# EasyEDA Pro project esp32-toy-motor-controller.eprj

# Schematic ESP32 Toy Motor Controller
Board Name: ESP32ToyMotorBoard; Create Date: 2026-01-25; Page Name: P1; Project Name: esp32-toy-motor-controller; Schematic Name: ESP32 Toy Motor Controller; Update Date: 2026-02-21; Company: stig@sdm.nz; Page Size: A4; Version: V1.1
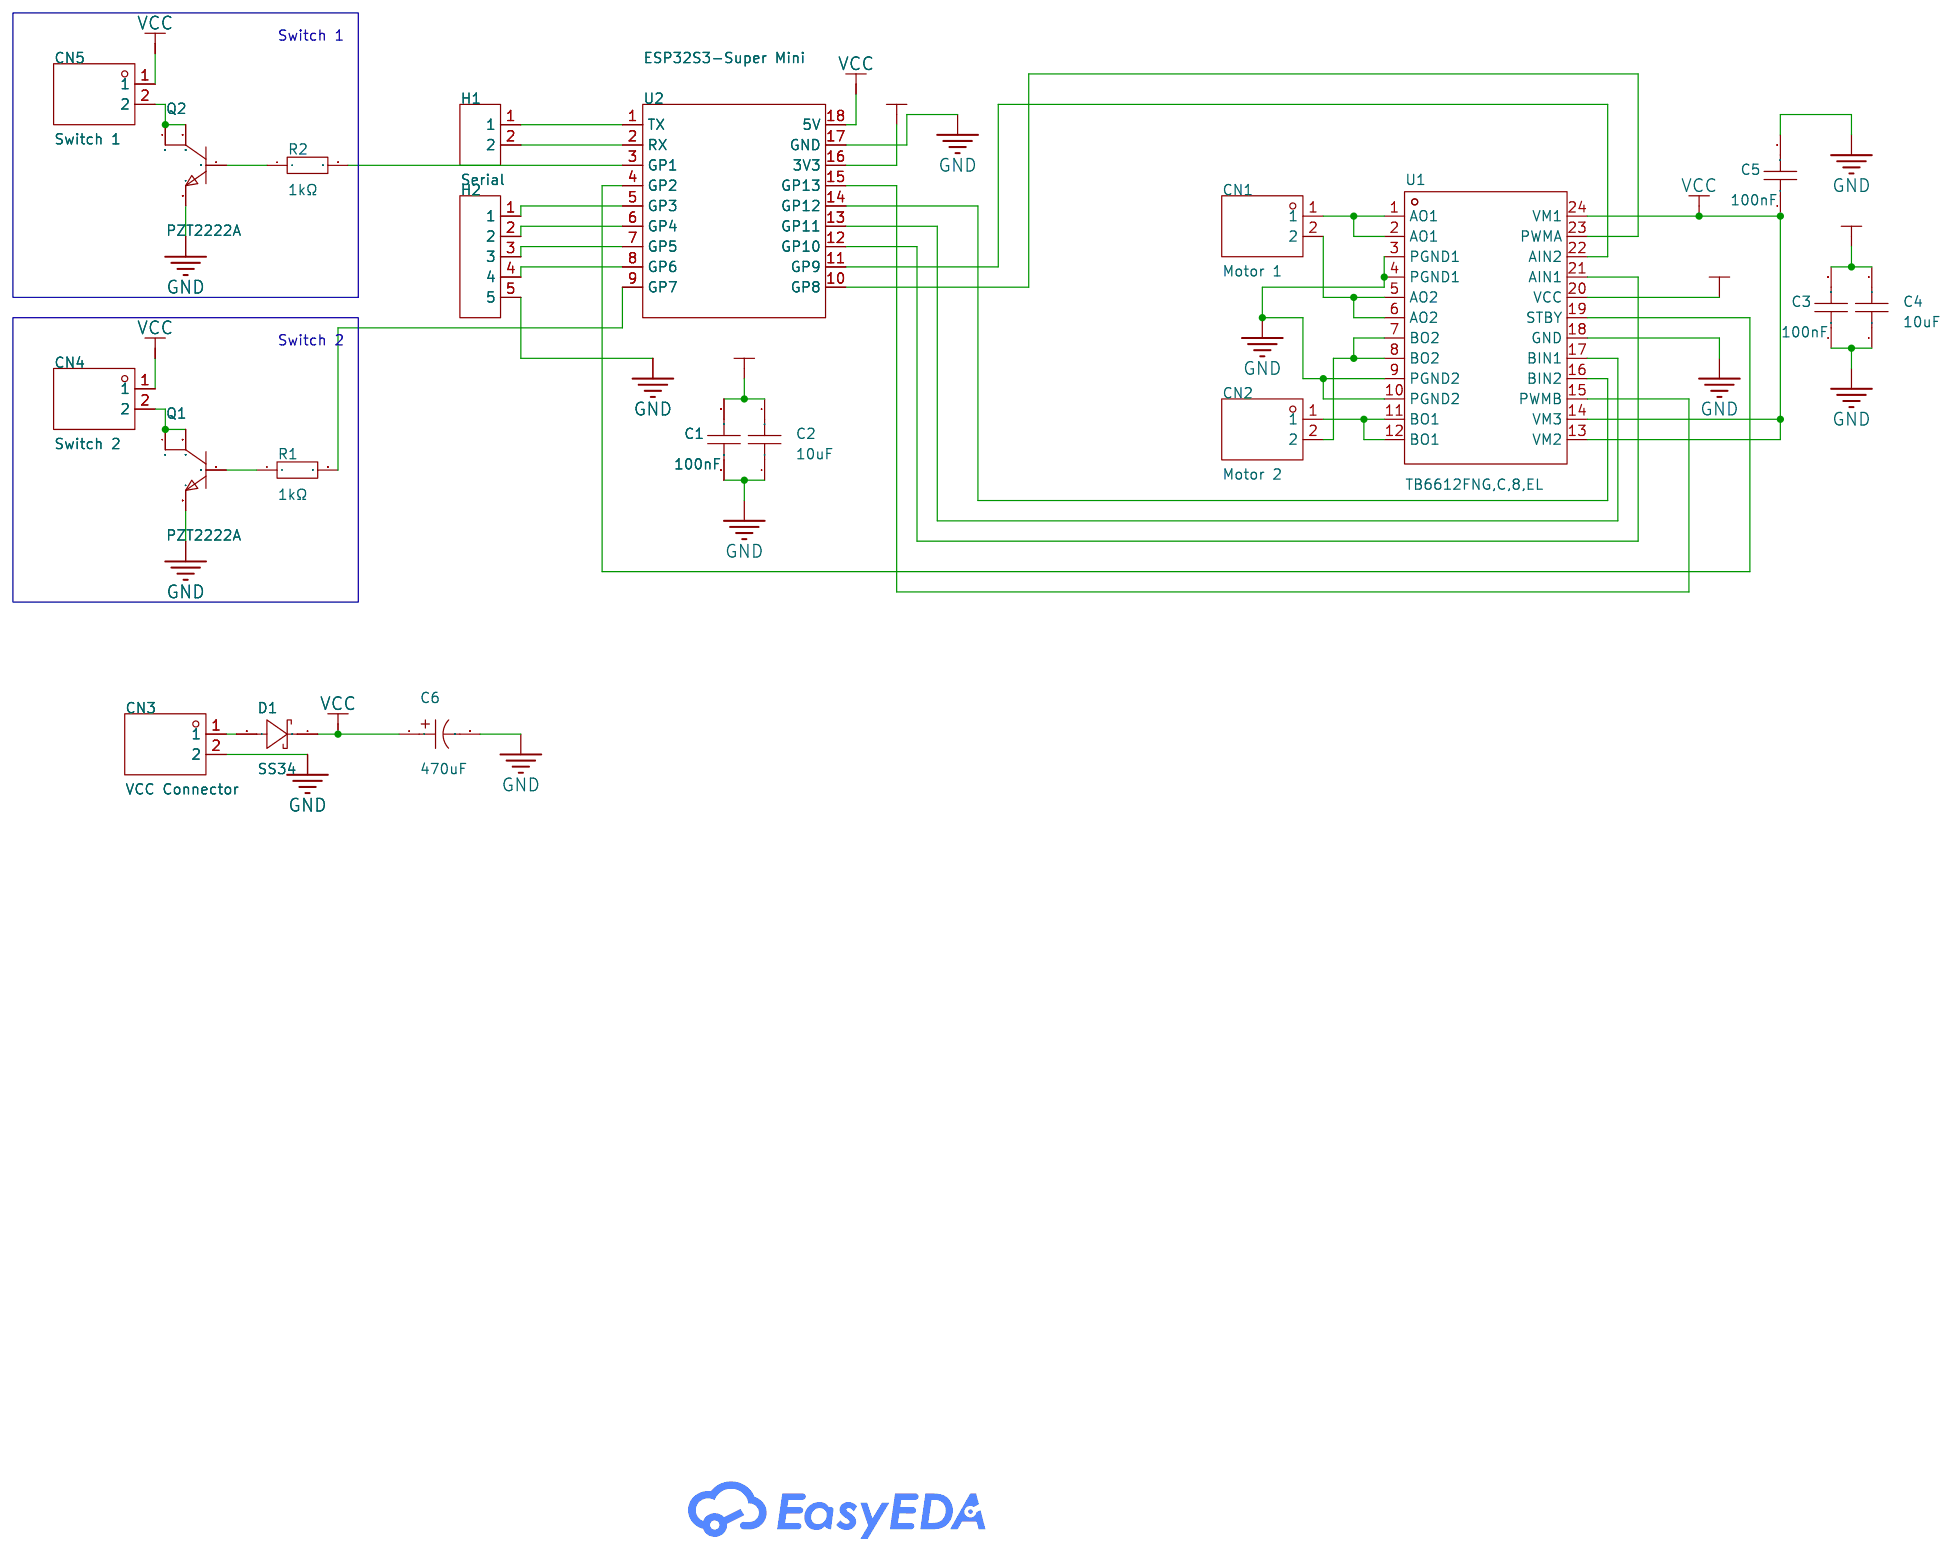
[diagram p0: schematic sheet]

## Parts
C1  100nF  [C0805]
C2  10uF  [C0805]
C3  100nF  [C0805]
C4  10uF  [C0805]
C5  100nF  [C0805]
C6  470uF  [CAP-TH_BD8.0-P3.50-D0.5-FD]
CN1  Motor 1  [CONN-TH_B2B-XH-A-LF-SN]
CN2  Motor 2  [CONN-TH_B2B-XH-A-LF-SN]
CN3  VCC Connector  [CONN-TH_B2B-XH-A-LF-SN]
CN4  Switch 2  [CONN-TH_B2B-XH-A-LF-SN]
CN5  Switch 1  [CONN-TH_B2B-XH-A-LF-SN]
D1  SS34  [SMA_L4.3-W2.5-LS5.0-RD]
H1  Serial  [HDR-TH_2P-P2.54-V-M]
H2  IO  [HDR-TH_5P-P2.54-V-M-3]
Q1  PZT2222A  [SOT-223-3_L6.5-W3.4-P2.30-LS7.0-BR]
Q2  PZT2222A  [SOT-223-3_L6.5-W3.4-P2.30-LS7.0-BR]
R1  1kΩ  [R0805]
R2  1kΩ  [R0805]
U1  TB6612FNG,C,8,EL  [SSOP-24_L8.3-W5.6-P0.65-LS7.6-BL]
U2  ESP32S3-Super Mini  [COMM-SMD_16P-L22.5-W18.0-P2.54-TL]

## Library data of the parts
C1 C3 C5 = CT41G-0805-2X1-50V-0.1uF-K(N): Capacitance:100nF Tolerance:±10% Tolerance:±10% Voltage Rating:50V Temperature Coefficient:-; LCSC Part Name: 100nF ±10% 50V; Supplier Part: C126469; Manufacturer: TORCH(火炬); Supplier Footprint: 0805; JLCPCB Part Class: Extended Part; Datasheet: https://item.szlcsc.com/datasheet/CT41G-0805-2X1-50V-0.1uF-K(N)/137749.html; Supplier: LCSC; Tolerance: ±10%; Voltage Rating: 50V
C2 C4 = GRM21BR61H106KE43L: Capacitance:10uF Tolerance:±10% Tolerance:±10% Voltage Rating:50V Temperature Coefficient:X5R; LCSC Part Name: 10uF ±10% 50V; Supplier Part: C440198; Manufacturer: muRata(村田); Supplier Footprint: 0805; JLCPCB Part Class: Basic Part; Datasheet: https://item.szlcsc.com/datasheet/GRM21BR61H106KE43L/439567.html; Supplier: LCSC; Tolerance: ±10%; Voltage Rating: 50V; Temperature Coefficient: X5R
C6 = 16V470uF CD110: LCSC Part Name: 470uF ±20% 16V; Supplier Part: C2960230; Manufacturer: HRK(鸿瑞凯电子); Supplier Footprint: 插件,D8xL12mm; JLCPCB Part Class: Extended Part; Supplier: LCSC; Tolerance: ±20%; Voltage Rating: 16V; Pin Spacing: 3.5mm; Diameter: 8mm; Height - Seated (Max): 12mm; Operating Temperature: -40℃~+105℃
CN1-CN5 = B2B-XH-A(LF)(SN): Pins Structure:1x2P Pitch:2.5mm Mounting Type:Through Hole Reference Series:XH Number of Pins:2P Number of Rows:1 Number of PINs Per Row:2 Row Spacing:- Current Rating:3A Contact Material:Brass Contact Plating:Tin Operating Temperature:-25℃~+85℃ Operating; LCSC Part Name: 1x2P 间距:2.5mm 直插 系列:XH; Supplier Part: C158012; Manufacturer: JST; Supplier Footprint: 插件,P=2.5mm; JLCPCB Part Class: Extended Part; Datasheet: https://item.szlcsc.com/datasheet/B2B-XH-A(LF)(SN)/169360.html; Supplier: LCSC; Pins Structure: 1x2P; Pitch: 2.5mm; Mounting Type: Through Hole; Reference Series: XH; Number of Pins: 2P; Number of Rows: 1; Number of PINs Per Row: 2; Current Rating: 3A; Contact Material: Brass; Contact Plating: Tin; Operating Temperature: -25℃~+85℃; Voltage Rating: 250V; Plastic Material: PA66; Flame Retardant Rating: UL94V-0; Supplementary Features: K Pin; Color: White; Z-Height of the Board: 7mm; X-Length of Bottom Edge on Board (Spacing Line): 7.4mm; Y-Width of Bottom Edge on Board: 5.75mm
D1 = SS34_C20622488: LCSC Part Name: 电压:40V 电流:3A; Supplier Part: C20622488; Manufacturer: Wild Goose(威谷); Supplier Footprint: SMA(DO-214AC); JLCPCB Part Class: Extended Part; Datasheet: https://item.szlcsc.com/datasheet/SS34/22012713.html; Supplier: LCSC; Voltage - Forward(Vf@If): 700mV@3A; Voltage - DC Reverse(Vr): 40V; Current - Rectified: 3A; Reverse Leakage Current (Ir): 300uA@40V; Operating Junction Temperature Range: -55℃~+125℃; Non-Repetitive Peak Forward Surge Current: 80A
H1 = HX PH254-01-02-Z-L11.5 male header connector: LCSC Part Name: 1x2P 间距:2.54mm 方针 直插; Supplier Part: C52016390; Manufacturer: hanxia(韩下); Supplier Footprint: 插件,P=2.54mm; JLCPCB Part Class: Extended Part; Datasheet: https://item.szlcsc.com/datasheet/HX%2520PH254-01-02-Z-L11.5%2520male%2520header%2520connector/54760435.html; Supplier: LCSC; Pin Structure: 1x2P; Pitch: 2.54mm; Circluar Pins/Square Pins: Pin Header; Mounting Type: Through Hole; Number of Rows: 1; Number of Pins: 2P; Current Rating: 3A; Voltage Rating (Max): 1kV; Length of Mating Pin: 6mm; Insulation Height: 2.5mm; Length of End Connection Pin: 3mm; Contact Material: Brass; Contact Plating: Gold; Operating Temperature: -40℃~+105℃
H2 = PZ2.54-S05P-A60: LCSC Part Name: 1x5P 间距:2.54mm 方针 直插; Supplier Part: C42431825; Manufacturer: JXTCONN(聚兴泰); Supplier Footprint: 插件,P=2.54mm; JLCPCB Part Class: Extended Part; Datasheet: https://item.szlcsc.com/datasheet/PZ2.54-S05P-A60/44458955.html; Supplier: LCSC; Pin Structure: 1x5P; Pitch: 2.54mm; Circluar Pins/Square Pins: Pin Header; Mounting Type: Through Hole; Number of Rows: 1; Number of Pins: 5P; Current Rating: 3A; Length of Mating Pin: 6mm; Insulation Height: 2.5mm; Length of End Connection Pin: 3mm; Contact Material: Brass; Contact Plating: Gold; Operating Temperature: -40℃~+105℃; Color: Black
Q1 Q2 = PZT2222A: LCSC Part Name: NPN 电流:600mA 电压:40V; Supplier Part: C189428; Manufacturer: CJ(江苏长电/长晶); Supplier Footprint: SOT-223; JLCPCB Part Class: Extended Part; Datasheet: https://item.szlcsc.com/datasheet/PZT2222A/200861.html; Supplier: LCSC; type: NPN; Current - Collector(Ic): 600mA; Collector - Emitter Voltage VCEO: 40V; Pd - Power Dissipation: 1W; DC Current Gain: 35@0.1mA,10V; Transition frequency(fT): 300MHz; Current - Collector Cutoff: 10nA; Vce Saturation(VCE(sat)): 1V@500mA,50mA; Operating Temperature: -55℃~+150℃; Number: 1 NPN
R1 R2 = 0805W8F1001T5E: LCSC Part Name: 1kΩ ±1% 125mW 厚膜电阻; Supplier Part: C17513; Manufacturer: UNI-ROYAL(厚声); Supplier Footprint: 0805; JLCPCB Part Class: Basic Part; Datasheet: https://atta.szlcsc.com/upload/public/pdf/source/20200306/C422600_1E6D84923E4A46A82E41ADD87F860B5C.pdf; Supplier: LCSC; Type: Thick Film Resistors; Tolerance: ±1%; Temperature Coefficient: ±100ppm/℃; Operating Temperature Range: -55℃~+155℃
U1 = TB6612FNG,C,8,EL: Peak Current:3.2A Voltage - Supply:2.7V~5.5V Voltage - Supply:2.7V~5.5V RDS(on):500mΩ Quiescent Current(Iq):1uA Operating Temperature:-20℃~+85℃ Operating Temperature:-20℃~+85℃; LCSC Part Name: 1A 有刷直流电机驱动芯片 5.5V; Supplier Part: C141517; Manufacturer: TOSHIBA(东芝); Supplier Footprint: SSOP-24; JLCPCB Part Class: Extended Part; Datasheet: https://item.szlcsc.com/datasheet/TB6612FNG%252CC%252C8%252CEL/152848.html; Supplier: LCSC; Peak Current: 3.2A; Voltage - Supply: 2.7V~5.5V; RDS(on): 500mΩ; Quiescent Current(Iq): 1uA; Operating Temperature: -20℃~+85℃
U2 = ESP32C3-SuperMini: LCSC Part Name: ESP32C3-Super Mini; Supplier Footprint: SMD-18P

## Nets
+3.3V: C1.2 C2.2 C3.2 C4.2 U1.20(VCC) U2.16(3V3)
GND: C1.1 C2.1 C3.1 C4.1 C5.2 C6.2 CN3.2 H2.5 Q1.3(E) Q2.3(E) U1.3(PGND1) U1.4(PGND1) U1.9(PGND2) U1.10(PGND2) U1.18(GND) U2.17(GND)
VCC: C5.1 C6.1 CN4.1 CN5.1 D1.1(C) U1.13(VM2) U1.14(VM3) U1.24(VM1) U2.18(5V)
A02: CN1.2 U1.5(AO2) U1.6(AO2)
AIN1: U1.21(AIN1) U2.12(GP10)
AIN2: U1.22(AIN2) U2.11(GP9)
AO1: CN1.1 U1.1(AO1) U1.2(AO1)
BIN1: U1.17(BIN1) U2.13(GP11)
BIN2: U1.16(BIN2) U2.14(GP12)
BO1: CN2.1 U1.11(BO1) U1.12(BO1)
BO2: CN2.2 U1.7(BO2) U1.8(BO2)
PWMA: U1.23(PWMA) U2.10(GP8)
PWMB: U1.15(PWMB) U2.15(GP13)
STBY: U1.19(STBY) U2.4(GP2)
SW1: R2.2 U2.3(GP1)
SW2: R1.2 U2.9(GP7)
$1N6935: Q1.1(B) R1.1
$1N6943: Q2.1(B) R2.1
$1N7006: CN4.2 Q1.2(C) Q1.4(C)
$1N7090: CN5.2 Q2.2(C) Q2.4(C)
$1N8505: H1.1 U2.1(TX)
$1N8509: H1.2 U2.2(RX)
$1N8565: H2.1 U2.5(GP3)
$1N8569: H2.2 U2.6(GP4)
$1N8574: H2.3 U2.7(GP5)
$1N8579: H2.4 U2.8(GP6)
$1N11196: CN3.1 D1.2(A)

## Notes on the sheet
- Switch 1
- Switch 2

# Board controller-pcb
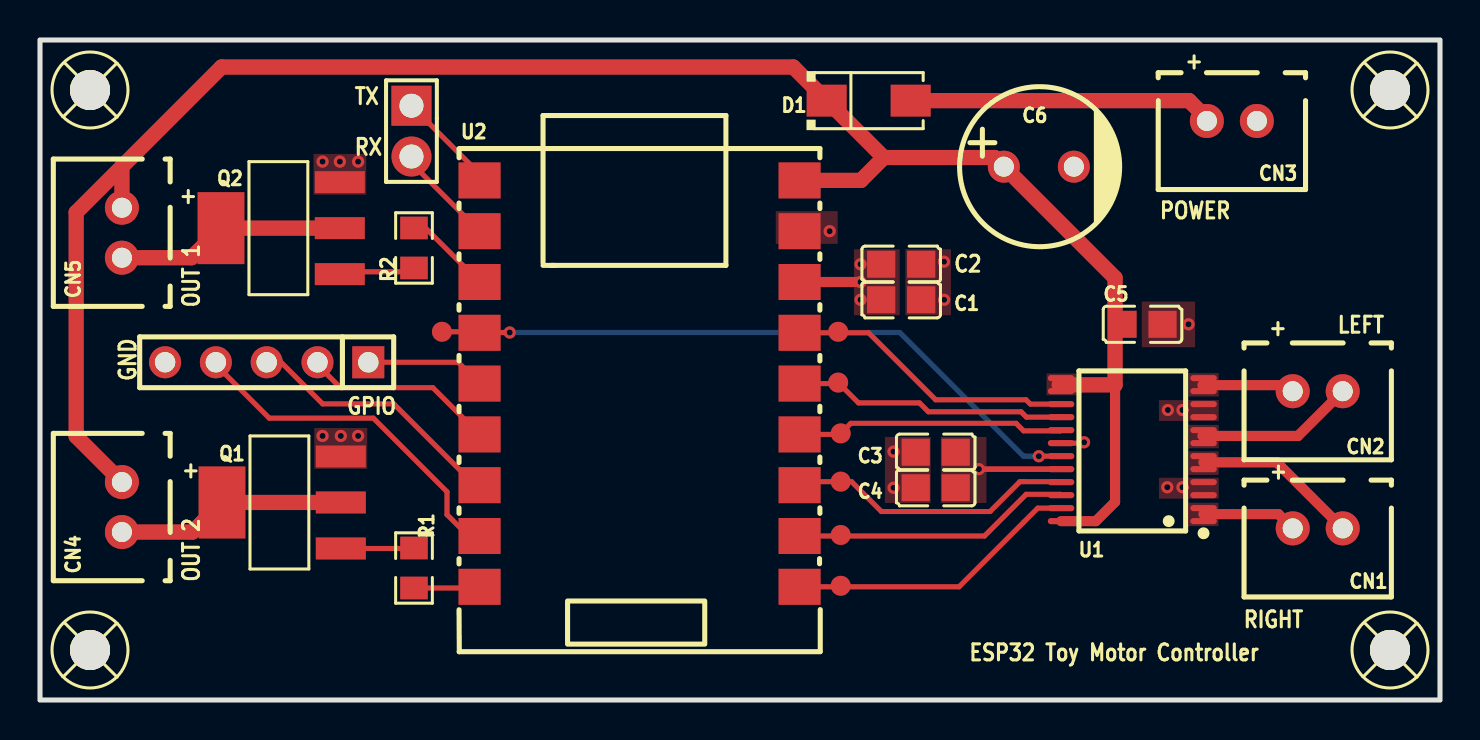
[diagram p1: board, top side]
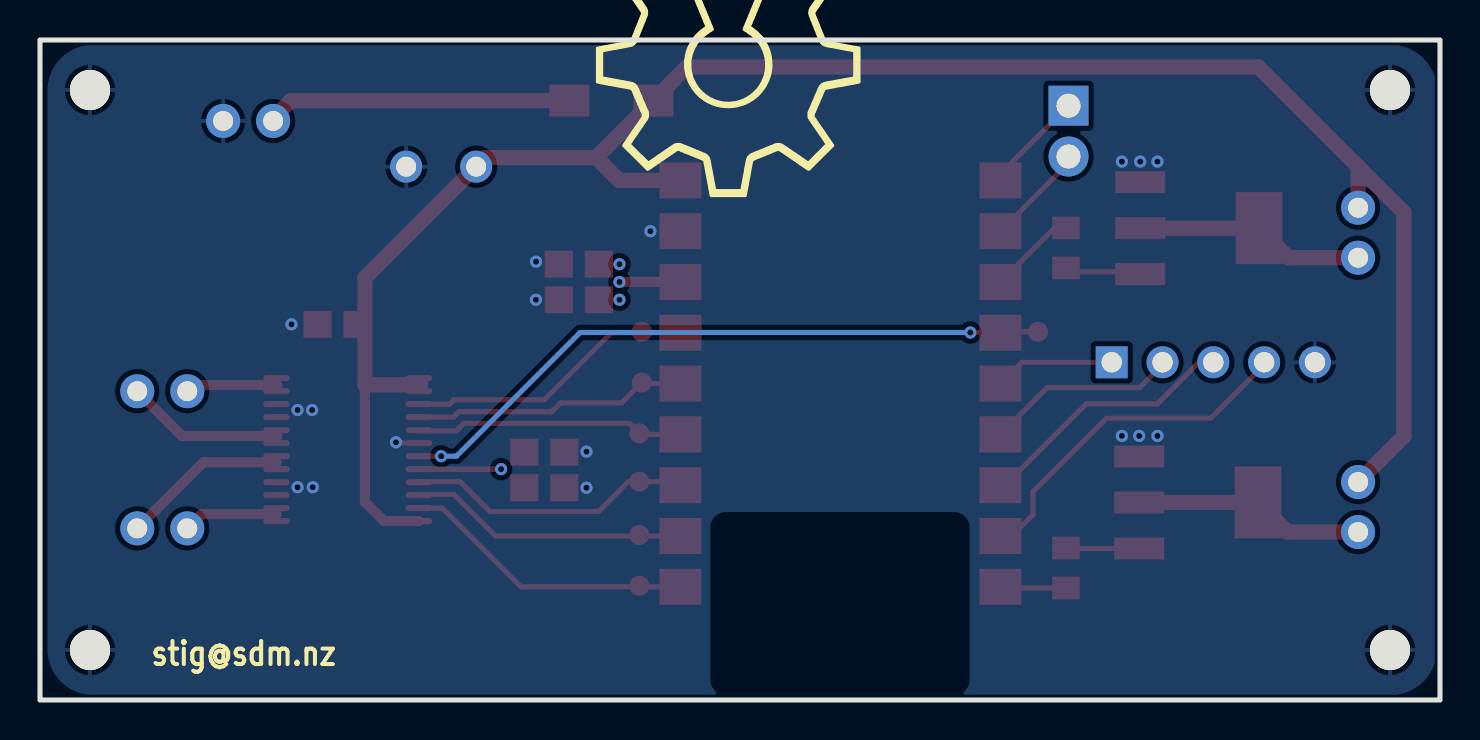
[diagram p2: board, bottom side, seen from below]

Outline 70 x 33 mm; copper layers: Top Layer, InnerGround, Inner3.3v, Bottom Layer. Coordinates in mm from the lower left corner of the outline.
Outline path: rectangle 0,33 70,0
Stack: Top Layer 0.035mm Outer layer thickness 1oz / Dielectric1 0.2104mm 7628 RC49% 8.6mil / InnerGround 0.0152mm Inner layer thickness / Dielectric2 1.065mm 1.1mm H/HOZ Copper / Inner3.3v 0.0152mm Inner layer thickness / Dielectric3 0.2104mm 7628 RC49% 8.6mil / Bottom Layer 0.035mm Outer layer thickness 1oz

## Design rules (mm)
template: JLCPCB Capability(Two Layers Board)
spacing copperThickness1oz (default): track to track 0.102, other pairs 0.152 to 0.3
spacing copperThickness2oz: track to track 0.203, other pairs 0.152 to 0.3
track width copperThickness1oz (default): min 0.127, default 0.254, max 2.54
track width copperThickness2oz: min 0.203, default 0.254, max 2.54
differential pair differentialPair (default): width min 0.127, default 0.254, max 2.54; gap min 0.152, default 0.152
via viaSize (default): diameter min 0.5, default 0.61, max 10; hole min 0.3, default 0.305, max 6.3

## Placement (name value [footprint] x y rotation side)
C1  100nF  [C0805]  43.06 20.01 180 top
C2  10uF  [C0805]  43.06 21.79 180 top
C3  100nF  [C0805]  44.79 12.39 0 top
C4  10uF  [C0805]  44.79 10.61 0 top
C5  100nF  [C0805]  55.13 18.78 0 top
C6  470uF  [CAP-TH_BD8.0-P3.50-D0.5-FD]  49.94 26.67 0 top
CN1  Motor 1  [CONN-TH_B2B-XH-A-LF-SN]  63.89 8.58 180 top
CN2  Motor 2  [CONN-TH_B2B-XH-A-LF-SN]  63.89 15.44 180 top
CN3  VCC Connector  [CONN-TH_B2B-XH-A-LF-SN]  59.59 28.95 180 top
CN4  Switch 2  [CONN-TH_B2B-XH-A-LF-SN]  4.09 9.65 90 top
CN5  Switch 1  [CONN-TH_B2B-XH-A-LF-SN]  4.09 23.36 90 top
D1  SS34  [SMA_L4.3-W2.5-LS5.0-RD]  41.43 29.97 0 top
H1  Serial  [HDR-TH_2P-P2.54-V-M]  18.57 28.44 270 top
H2  IO  [HDR-TH_5P-P2.54-V-M-3]  11.33 16.89 180 top
NOREF  -  [Pad_e231]  20.1 18.41 0 top
NOREF#2  -  [Pad_e243]  40.04 10.92 0 top
NOREF#3  -  [Pad_e245]  40.04 13.33 0 top
NOREF#4  -  [Pad_e247]  39.91 18.41 0 top
NOREF#5  -  [Pad_e418]  40.04 8.25 0 top
NOREF#6  -  [Pad_e246]  39.91 15.87 0 top
NOREF#7  -  [Pad_e244]  40.04 5.71 0 top
Q1  PZT2222A  [SOT-223-3_L6.5-W3.4-P2.30-LS7.0-BR]  12.07 9.88 0 top
Q2  PZT2222A  [SOT-223-3_L6.5-W3.4-P2.30-LS7.0-BR]  12.02 23.59 0 top
R1  1kΩ  [R0805]  18.7 6.6 270 top
R2  1kΩ  [R0805]  18.7 22.6 90 top
SCREW1  -  [Screw-Hole-M2]  2.5 30.5 0 top
SCREW2  -  [Screw-Hole-M2]  2.5 2.5 0 top
SCREW3  -  [Screw-Hole-M2]  67.5 30.5 0 top
SCREW4  -  [Screw-Hole-M2]  67.5 2.5 0 top
U1  TB6612FNG,C,8,EL  [SSOP-24_L8.3-W5.6-P0.65-LS7.6-BL]  54.62 12.52 90 top
U2  ESP32S3-Super Mini  [COMM-SMD_16P-L22.5-W18.0-P2.54-TL]  29.98 17.09 0 top

## Footprints (pads in the part's own frame, mm; a bottom-side part is the same pattern mirrored in y, then rotated)
C0805
  rect 1.41x1.35 smd: 1(-1,0) 2(1,0)
CAP-TH_BD8.0-P3.50-D0.5-FD
  round 1.6 hole 1: 1(-1.75,0) 2(1.75,0)
COMM-SMD_16P-L22.5-W18.0-P2.54-TL
  rect 2.102x1.802 smd: 1(-8.001,8.89) 2(-8.001,6.35) 3(-8.001,3.81) 4(-8.001,1.27) 5(-8.001,-1.27) 6(-8.001,-3.81) 7(-8.001,-6.35) 8(-8.001,-8.89) 9(-8.001,-11.43) 10(8.001,-11.43) 11(8.001,-8.89) 12(8.001,-6.35) 13(8.001,-3.81) 14(8.001,-1.27) 15(8.001,1.27) 16(8.001,3.81) 17(8.001,6.35) 18(8.001,8.89)
CONN-TH_B2B-XH-A-LF-SN
  round 1.7 hole 1: 1(1.25,0) 2(-1.25,0)
HDR-TH_2P-P2.54-V-M
  rect 2x2 hole 1.2: 1(-1.27,0)
  round 2 hole 1.2: 2(1.27,0)
HDR-TH_5P-P2.54-V-M-3
  rect 1.6x1.6 hole 1.02: 1(-5.08,0)
  round 1.6 hole 1.02: 2(-2.54,0) 3(0,0) 4(2.54,0) 5(5.08,0)
Pad_e231
  round 1 smd: TP4(0,0)
Pad_e243
  round 1 smd: TP5(0,0)
Pad_e244
  round 1 smd: TP8(0,0)
Pad_e245
  round 1 smd: TP3(0,0)
Pad_e246
  round 1 smd: TP2(0,0)
Pad_e247
  round 1 smd: TP1(0,0)
Pad_e418
  round 1 smd: TP7(0,0)
R0805
  rect 1.133x1.377 smd: 1(-1,0) 2(1,0)
Screw-Hole-M2
  round 2 hole 2: 1(0,0)
SMA_L4.3-W2.5-LS5.0-RD
  rect 2x1.593 smd: 1(-2.1,0) 2(2.1,0)
SOT-223-3_L6.5-W3.4-P2.30-LS7.0-BR
  rect 2.5x1.1 smd: 1(2.97,-2.3) 2(2.97,0) 3(2.97,2.3)
  rect 2.34x3.6 smd: 4(-2.97,0)
SSOP-24_L8.3-W5.6-P0.65-LS7.6-BL
  oval 0.308x1.324 smd: 1(-3.575,-3.562) 2(-2.925,-3.562) 3(-2.275,-3.562) 4(-1.625,-3.562) 5(-0.975,-3.562) 6(-0.325,-3.562) 7(0.325,-3.562) 8(0.975,-3.562) 9(1.625,-3.562) 10(2.275,-3.562) 11(2.925,-3.562) 12(3.575,-3.562) 13(3.575,3.562) 14(2.925,3.562) 15(2.275,3.562) 16(1.625,3.562) 17(0.975,3.562) 18(0.325,3.562) 19(-0.325,3.562) 20(-0.975,3.562) 21(-1.625,3.562) 22(-2.275,3.562) 23(-2.925,3.562) 24(-3.575,3.562)

## Nets
+3.3V: C1.2 C2.2 C3.2 C4.2 U1.20 U2.16
GND: C1.1 C2.1 C3.1 C4.1 C5.2 C6.2 CN3.2 H2.5 Q1.3 Q2.3 SCREW1.1 SCREW2.1 SCREW3.1 SCREW4.1 U1.3 U1.4 U1.9 U1.10 U1.18 U2.17
VCC: C5.1 C6.1 CN4.1 CN5.1 D1.1 U1.13 U1.14 U1.24 U2.18
A02: CN1.2 U1.5 U1.6
AIN1: NOREF#2.TP5 U1.21 U2.12
AIN2: NOREF#5.TP7 U1.22 U2.11
AO1: CN1.1 U1.1 U1.2
BIN1: NOREF#3.TP3 U1.17 U2.13
BIN2: NOREF#6.TP2 U1.16 U2.14
BO1: CN2.1 U1.11 U1.12
BO2: CN2.2 U1.7 U1.8
PWMA: NOREF#7.TP8 U1.23 U2.10
PWMB: NOREF#4.TP1 U1.15 U2.15
STBY: NOREF.TP4 U1.19 U2.4
SW1: R2.2 U2.3
SW2: R1.2 U2.9
$1N6935: Q1.1 R1.1
$1N6943: Q2.1 R2.1
$1N7006: CN4.2 Q1.2 Q1.4
$1N7090: CN5.2 Q2.2 Q2.4
$1N8505: H1.1 U2.1
$1N8509: H1.2 U2.2
$1N8565: H2.1 U2.5
$1N8569: H2.2 U2.6
$1N8574: H2.3 U2.7
$1N8579: H2.4 U2.8
$1N11196: CN3.1 D1.2

## Via types
v1: diameter 0.61, hole 0.305, Top Layer to Bottom Layer, 23 vias

## Routing (per net, layer and track width the routed paths; a pad name or vN(x,y) marks a point on that pad's centre or on a via; arc(x,y) is an arc through that point)
+3.3V: length 7.2
  Top Layer w0.28: v1(46.94,11.54) U1.20
  Top Layer w0.508: U2.16 v1(41.03,20.9)
  vias: v1(41.03,21.79) v1(41.03,20.01)
GND: length 1.2
  Top Layer w0.254: U1.18 52.16,12.84 v1(52.2,12.89)
  vias: v1(14.13,26.92) v1(14.13,13.2) v1(14.99,26.92) v1(15.04,13.2) v1(15.91,26.92) v1(15.91,13.2) v1(39.48,23.44) v1(42.68,12.42) v1(42.68,10.61) v1(45.2,21.92) v1(45.21,20.01) v1(56.39,14.5) v1(56.36,10.64) v1(57.12,14.5) v1(57.12,10.64) v1(57.43,18.78)
VCC: length 97.6
  Top Layer w0.508: 53.75,15.76 53.75,9.9 52.79,8.94 U1.24
  Top Layer w0.762: U2.18 41.05,25.98 42.19,27.12 ; 42.19,27.12 47.74,27.12 53.75,21.11 53.75,15.76 50.96,15.76 ; 42.19,27.12 37.66,31.65 9.08,31.65 4.09,26.67 ; 4.09,26.67 CN5.1 ; 4.09,26.67 1.81,24.38 1.81,13.18 CN4.1
A02: length 8.3
  Top Layer w0.508: CN1.2 61.83,11.88 58.17,11.88
AIN1: length 14.4
  Top Layer w0.254: U2.12 38.16,10.92 NOREF#2.TP5 40.57,10.92 42.07,9.42 47.5,9.42 49,10.92 51.03,10.92 U1.21
AIN2: length 14
  Top Layer w0.254: U2.11 47.22,8.2 49.31,10.28 51.01,10.28 U1.22
AO1: length 4.8
  Top Layer w0.508: CN1.1 61.93,9.29 58.17,9.29
BIN1: length 13.5
  Top Layer w0.254: 51.05,13.49 51.02,13.46 49.18,13.46 48.8,13.83 40.54,13.83 39.99,13.28 U2.13
BIN2: length 13.8
  Top Layer w0.254: U1.16 49.32,14.14 49.18,14.28 49.05,14.41 44.42,14.41 43.97,14.86 40.93,14.86 39.96,15.82 U2.14
BO1: length 4.6
  Top Layer w0.508: 58.12,15.74 62.33,15.74 CN2.1
BO2: length 7.9
  Top Layer w0.508: CN2.2 62.9,13.2 58.12,13.2
PWMA: length 14.7
  Top Layer w0.254: U1.23 49.89,9.59 45.95,5.66 U2.10
PWMB: length 14.6
  Top Layer w0.254: 51.05,14.79 49.52,14.79 49.3,15.01 44.78,15.01 41.43,18.36 U2.15
STBY: length 33.7
  Top Layer w0.254: v1(23.48,18.38) 21.99,18.38 U2.4 21.93,18.41 NOREF.TP4 ; v1(49.94,12.19) 49.95,12.19 51.05,12.19
  Bottom Layer w0.254: 23.56,18.45 v1(23.48,18.38) 42.99,18.38 49.18,12.19 v1(49.94,12.19)
SW1: length 4.4
  Top Layer w0.254: R2.2 19.28,23.6 U2.3
SW2: length 3.3
  Top Layer w0.254: U2.9 21.92,5.6 R1.2
$1N6935: length 3.7
  Top Layer w0.254: R1.1 18.68,7.58 Q1.1
$1N6943: length 3.8
  Top Layer w0.254: R2.1 18.51,21.41 15.11,21.41 Q2.1
$1N7006: length 11.6
  Top Layer w0.762: Q1.2 Q1.4 7.62,8.4 CN4.2
$1N7090: length 11.5
  Top Layer w0.762: CN5.2 7.57,22.11 Q2.4 Q2.2
$1N8505: length 5.1
  Top Layer w0.254: H1.1 21.98,26.31 U2.1
$1N8509: length 5.1
  Top Layer w0.254: U2.2 18.57,26.84 H1.2
$1N8565: length 6
  Top Layer w0.254: U2.5 20.91,16.89 H2.1
$1N8569: length 9.7
  Top Layer w0.254: H2.2 13.87,16.76 15.02,15.62 19.64,15.62 U2.6
$1N8574: length 13.3
  Top Layer w0.254: U2.7 21.75,10.74 17.69,14.81 14.13,14.81 11.87,17.07 11.51,17.07 H2.3
$1N8579: length 17.5
  Top Layer w0.254: U2.8 21.42,8.2 20.35,9.27 20.35,10.41 16.67,14.09 11.46,14.09 8.79,16.76 H2.4
$1N11196: length 15.3
  Top Layer w0.762: CN3.1 58.34,29.08 57.46,29.97 D1.2

## Copper pours and planes (outline as drawn; the poured copper is in the pictures)
+3.3V on Top Layer: 45.04,13.15 47.33,13.15 47.33,9.85 45.04,9.85
+3.3V on Top Layer: 40.69,22.54 42.98,22.54 42.98,19.23 40.69,19.23
+3.3V on Inner3.3v: 0.26,32.74 69.74,32.74 69.74,0.26 0.26,0.26
GND on Top Layer: 13.72,13.6 16.36,13.6 16.36,11.56 13.72,11.56
GND on Top Layer: 55.95,11.11 58.93,11.11 58.93,10.07 55.95,10.07
GND on Top Layer: 55.95,14.99 58.93,14.99 58.93,13.95 55.95,13.95
GND on Top Layer: 36.79,24.44 39.88,24.44 39.88,22.81 36.79,22.81
GND on Top Layer: 55.09,19.93 57.76,19.93 57.76,17.64 55.09,17.64
GND on Top Layer: 42.25,13.15 44.53,13.15 44.53,9.85 42.25,9.85
GND on Top Layer: 13.67,27.31 16.31,27.31 16.31,25.26 13.67,25.26
GND on Top Layer: 43.26,22.54 45.55,22.54 45.55,19.23 43.26,19.23
GND on Bottom Layer: 0.16,30.48 0.17,30.74 0.23,31.04 0.32,31.33 0.46,31.61 0.63,31.86 0.83,32.09 1.06,32.29 1.31,32.46 1.59,32.6 1.88,32.69 2.18,32.75 2.44,32.76 67.34,32.76 67.61,32.75 67.91,32.69 68.2,32.6 68.47,32.46 68.73,32.29 68.96,32.09 69.16,31.86 69.33,31.61 69.46,31.33 69.56,31.04 69.61,30.74 69.63,30.48 69.63,2.54 69.61,2.27 69.56,1.97 69.46,1.68 69.33,1.4 69.16,1.15 68.96,0.92 68.73,0.72 68.47,0.55 68.2,0.42 67.91,0.32 67.61,0.27 67.34,0.25 2.44,0.25 2.18,0.27 1.88,0.32 1.59,0.42 1.31,0.55 1.06,0.72 0.83,0.92 0.63,1.15 0.46,1.4 0.32,1.68 0.23,1.97 0.17,2.27 0.16,2.54
GND on InnerGround: 0.26,32.74 69.74,32.74 69.74,0.26 0.26,0.26
VCC on Top Layer: 50.32,16.33 51.82,16.33 51.82,15.24 50.32,15.24
A02 on Top Layer: 57.41,12.43 58.93,12.43 58.93,11.26 57.41,11.26
AO1 on Top Layer: 57.4,9.86 58.92,9.86 58.92,8.69 57.4,8.69
BO1 on Top Layer: 57.41,16.34 58.93,16.34 58.93,15.17 57.41,15.17
BO2 on Top Layer: 57.41,13.75 58.93,13.75 58.93,12.59 57.41,12.59

Small or netless copper shapes (teardrops, artwork), in the pictures only: 28 on InnerGround

## Text on the board
Bottom Silkscreen Layer: stig@sdm.nz
Top Silkscreen Layer: GPIO | TX | RX | + | C2 | ESP32 Toy Motor Controller | POWER | RIGHT | LEFT | GND | OUT 1 | OUT 2
